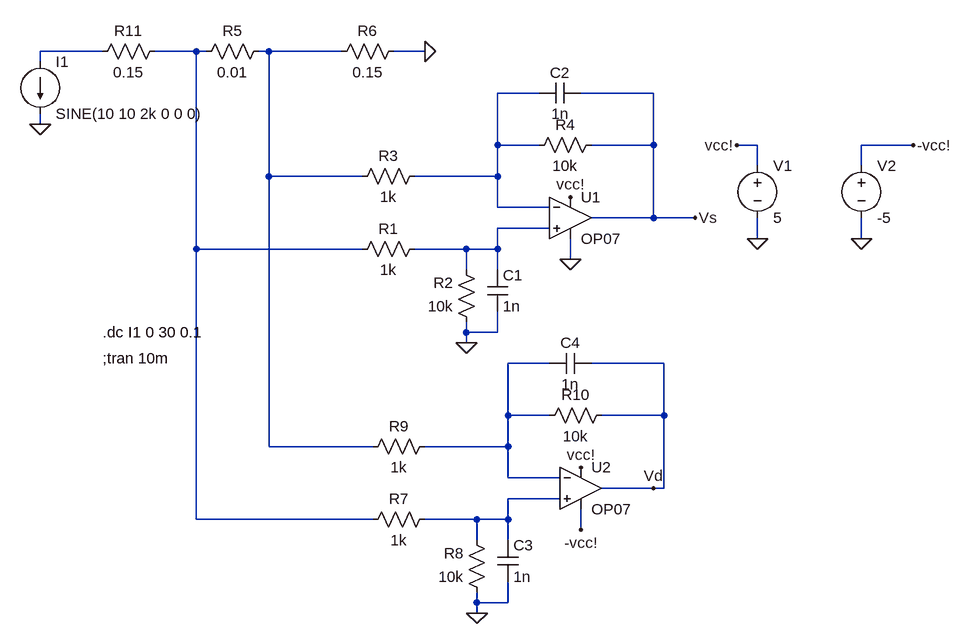
[diagram p0: schematic Draft1.asc]
Draft1.asc, the LTspice schematic file:
Version 4
SHEET 1 880 680
WIRE -656 -240 -752 -240
WIRE -512 -240 -576 -240
WIRE -496 -240 -512 -240
WIRE -400 -240 -416 -240
WIRE -288 -240 -400 -240
WIRE -160 -240 -208 -240
WIRE -752 -224 -752 -240
WIRE 16 -176 -48 -176
WIRE 192 -176 80 -176
WIRE -752 -128 -752 -144
WIRE -48 -96 -48 -176
WIRE 16 -96 -48 -96
WIRE 192 -96 192 -176
WIRE 192 -96 96 -96
WIRE 352 -96 320 -96
WIRE 592 -96 512 -96
WIRE 352 -64 352 -96
WIRE 512 -64 512 -96
WIRE -400 -48 -400 -240
WIRE -256 -48 -400 -48
WIRE -48 -48 -48 -96
WIRE -48 -48 -176 -48
WIRE -48 0 -48 -48
WIRE 32 0 -48 0
WIRE 192 16 192 -96
WIRE 192 16 96 16
WIRE 256 16 192 16
WIRE 32 32 -48 32
WIRE 352 48 352 16
WIRE 512 48 512 16
WIRE -512 64 -512 -240
WIRE -256 64 -512 64
WIRE -96 64 -176 64
WIRE -48 64 -48 32
WIRE -48 64 -96 64
WIRE 64 80 64 48
WIRE -96 96 -96 64
WIRE -48 96 -48 64
WIRE -96 192 -96 176
WIRE -48 192 -48 160
WIRE -48 192 -96 192
WIRE -96 208 -96 192
WIRE 32 240 -32 240
WIRE 208 240 96 240
WIRE -32 320 -32 240
WIRE 32 320 -32 320
WIRE 208 320 208 240
WIRE 208 320 112 320
WIRE -400 368 -400 -48
WIRE -240 368 -400 368
WIRE -32 368 -32 320
WIRE -32 368 -160 368
WIRE -32 416 -32 368
WIRE 48 416 -32 416
WIRE 192 432 112 432
WIRE 208 432 208 320
WIRE 208 432 192 432
WIRE 48 448 -32 448
WIRE -512 480 -512 64
WIRE -240 480 -512 480
WIRE -80 480 -160 480
WIRE -32 480 -32 448
WIRE -32 480 -80 480
WIRE 80 496 80 464
WIRE -80 512 -80 480
WIRE -32 512 -32 480
WIRE -80 608 -80 592
WIRE -32 608 -32 576
WIRE -32 608 -80 608
WIRE -80 624 -80 608
FLAG -96 208 0
FLAG 352 48 0
FLAG 320 -96 vcc!
FLAG 64 -16 vcc!
FLAG -752 -128 0
FLAG -160 -240 0
FLAG 512 48 0
FLAG 592 -96 -vcc!
FLAG 64 80 0
FLAG -80 624 0
FLAG 80 400 vcc!
FLAG 80 496 -vcc!
FLAG 256 16 Vs
FLAG 192 432 Vd
SYMBOL res -160 48 R90
WINDOW 0 0 56 VBottom 2
WINDOW 3 32 56 VTop 2
SYMATTR InstName R1
SYMATTR Value 1k
SYMBOL res -80 192 R180
WINDOW 0 36 76 Left 2
WINDOW 3 36 40 Left 2
SYMATTR InstName R2
SYMATTR Value 10k
SYMBOL res -160 -64 R90
WINDOW 0 0 56 VBottom 2
WINDOW 3 32 56 VTop 2
SYMATTR InstName R3
SYMATTR Value 1k
SYMBOL res 112 -112 R90
WINDOW 0 0 56 VBottom 2
WINDOW 3 32 56 VTop 2
SYMATTR InstName R4
SYMATTR Value 10k
SYMBOL voltage 352 -80 R0
WINDOW 123 0 0 Left 2
WINDOW 39 0 0 Left 2
SYMATTR InstName V1
SYMATTR Value 5
SYMBOL res -400 -256 R90
WINDOW 0 0 56 VBottom 2
WINDOW 3 32 56 VTop 2
SYMATTR InstName R5
SYMATTR Value 0.01
SYMBOL current -752 -224 R0
WINDOW 123 0 0 Left 2
WINDOW 39 0 0 Left 2
SYMATTR InstName I1
SYMATTR Value SINE(10 10 2k 0 0 0)
SYMBOL res -192 -256 R90
WINDOW 0 0 56 VBottom 2
WINDOW 3 32 56 VTop 2
SYMATTR InstName R6
SYMATTR Value 0.15
SYMBOL Opamps\\OP07 64 -48 R0
SYMATTR InstName U1
SYMBOL cap -64 96 R0
SYMATTR InstName C1
SYMATTR Value 1n
SYMBOL cap 80 -192 R90
WINDOW 0 0 32 VBottom 2
WINDOW 3 32 32 VTop 2
SYMATTR InstName C2
SYMATTR Value 1n
SYMBOL voltage 512 -80 R0
WINDOW 123 0 0 Left 2
WINDOW 39 0 0 Left 2
SYMATTR InstName V2
SYMATTR Value -5
SYMBOL res -144 464 R90
WINDOW 0 0 56 VBottom 2
WINDOW 3 32 56 VTop 2
SYMATTR InstName R7
SYMATTR Value 1k
SYMBOL res -64 608 R180
WINDOW 0 36 76 Left 2
WINDOW 3 36 40 Left 2
SYMATTR InstName R8
SYMATTR Value 10k
SYMBOL res -144 352 R90
WINDOW 0 0 56 VBottom 2
WINDOW 3 32 56 VTop 2
SYMATTR InstName R9
SYMATTR Value 1k
SYMBOL res 128 304 R90
WINDOW 0 0 56 VBottom 2
WINDOW 3 32 56 VTop 2
SYMATTR InstName R10
SYMATTR Value 10k
SYMBOL Opamps\\OP07 80 368 R0
SYMATTR InstName U2
SYMBOL cap -48 512 R0
SYMATTR InstName C3
SYMATTR Value 1n
SYMBOL cap 96 224 R90
WINDOW 0 0 32 VBottom 2
WINDOW 3 32 32 VTop 2
SYMATTR InstName C4
SYMATTR Value 1n
SYMBOL res -560 -256 R90
WINDOW 0 0 56 VBottom 2
WINDOW 3 32 56 VTop 2
SYMATTR InstName R11
SYMATTR Value 0.15
TEXT -656 232 Left 2 !;tran 10m
TEXT -656 192 Left 2 !.dc I1 0 30 0.1

The netlist it stands for:
* Draft1.asc
R1 N005 N002 1k
R2 0 N005 10k
R3 N004 N003 1k
R4 Vs N004 10k
V1 vcc! 0 5
R5 N003 N002 0.01
I1 N001 0 SINE(10 10 2k 0 0 0)
R6 0 N003 0.15
XU1 N005 N004 vcc! 0 Vs LT1001  ; OP07, pins In+ In- V+ V- OUT
C1 N005 0 1n
C2 Vs N004 1n
V2 -vcc! 0 -5
R7 N007 N002 1k
R8 0 N007 10k
R9 N006 N003 1k
R10 Vd N006 10k
XU2 N007 N006 vcc! -vcc! Vd LT1001  ; OP07, pins In+ In- V+ V- OUT
C3 N007 0 1n
C4 Vd N006 1n
R11 N002 N001 0.15
;tran 10m
.dc I1 0 30 0.1
.lib LTC.lib
.backanno
.end

* Results of the author's LTspice run, read from the files saved beside the schematic
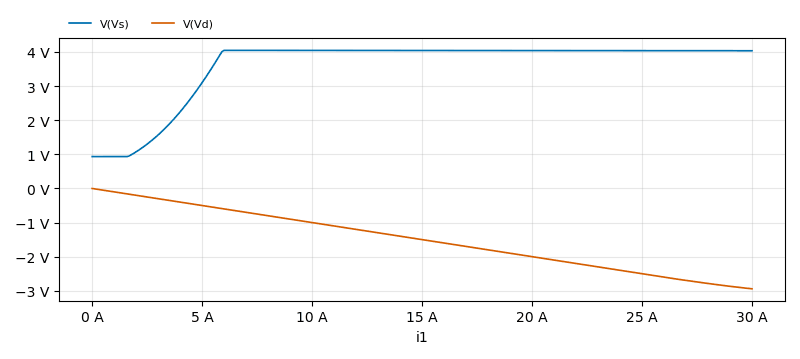
[diagram p1: DC transfer characteristic of Draft1.asc, plotted from the saved traces]
* DC transfer characteristic, 1 run:
*   V(Vs): 934.2 mV at i1=0 A, 4.035 V at i1=30 A, min 934.2 mV, max 4.046 V
*   V(Vd): -126.4 pV at i1=0 A, -2.94 V at i1=30 A, min -2.94 V, max -126.4 pV